# Altium schematic sheet Leds.SchDoc: Extension connectors
size A4; DocumentNumber: MB1136; Revision: C.3; SheetNumber: 4; SheetTotal: 4; Project: NUCLEO-XXXXRX
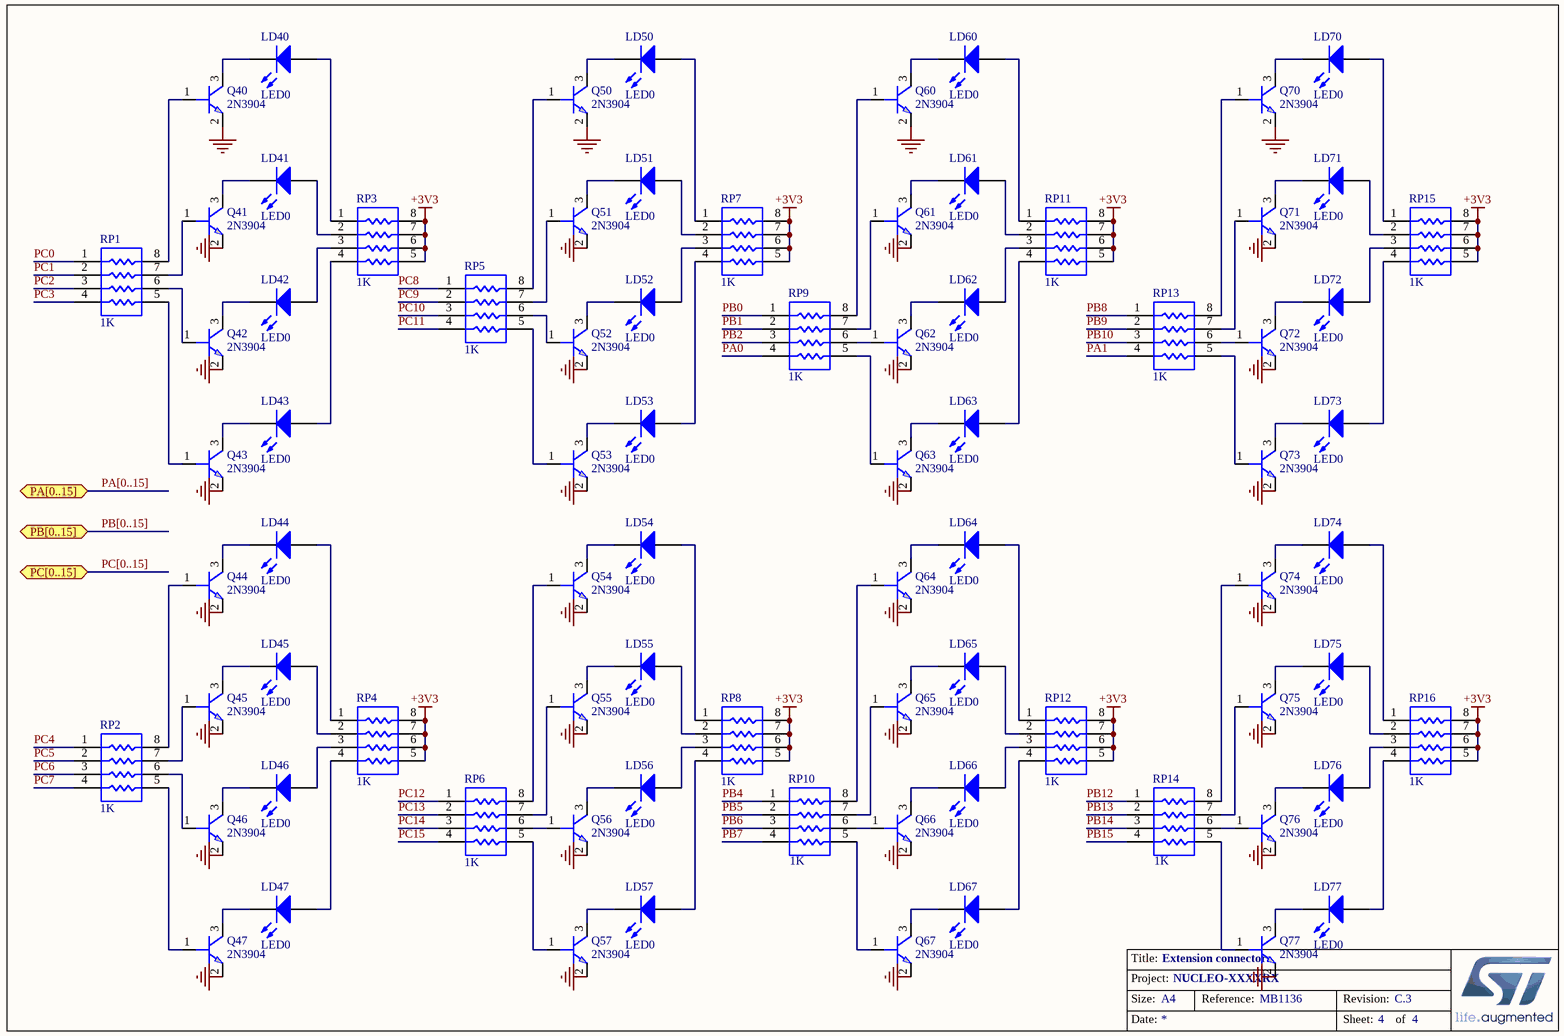
[diagram p0: Leds.SchDoc]

## Parts
LD40  LED0  [LED5]
LD41  LED0  [LED5]
LD42  LED0  [LED5]
LD43  LED0  [LED5]
LD44  LED0  [LED5]
LD45  LED0  [LED5]
LD46  LED0  [LED5]
LD47  LED0  [LED5]
LD50  LED0  [LED5]
LD51  LED0  [LED5]
LD52  LED0  [LED5]
LD53  LED0  [LED5]
LD54  LED0  [LED5]
LD55  LED0  [LED5]
LD56  LED0  [LED5]
LD57  LED0  [LED5]
LD60  LED0  [LED5]
LD61  LED0  [LED5]
LD62  LED0  [LED5]
LD63  LED0  [LED5]
LD64  LED0  [LED5]
LD65  LED0  [LED5]
LD66  LED0  [LED5]
LD67  LED0  [LED5]
LD70  LED0  [LED5]
LD71  LED0  [LED5]
LD72  LED0  [LED5]
LD73  LED0  [LED5]
LD74  LED0  [LED5]
LD75  LED0  [LED5]
LD76  LED0  [LED5]
LD77  LED0  [LED5]
Q40  2N3904  [SOT-23]
Q41  2N3904  [SOT-23]
Q42  2N3904  [SOT-23]
Q43  2N3904  [SOT-23]
Q44  2N3904  [SOT-23]
Q45  2N3904  [SOT-23]
Q46  2N3904  [SOT-23]
Q47  2N3904  [SOT-23]
Q50  2N3904  [SOT-23]
Q51  2N3904  [SOT-23]
Q52  2N3904  [SOT-23]
Q53  2N3904  [SOT-23]
Q54  2N3904  [SOT-23]
Q55  2N3904  [SOT-23]
Q56  2N3904  [SOT-23]
Q57  2N3904  [SOT-23]
Q60  2N3904  [SOT-23]
Q61  2N3904  [SOT-23]
Q62  2N3904  [SOT-23]
Q63  2N3904  [SOT-23]
Q64  2N3904  [SOT-23]
Q65  2N3904  [SOT-23]
Q66  2N3904  [SOT-23]
Q67  2N3904  [SOT-23]
Q70  2N3904  [SOT-23]
Q71  2N3904  [SOT-23]
Q72  2N3904  [SOT-23]
Q73  2N3904  [SOT-23]
Q74  2N3904  [SOT-23]
Q75  2N3904  [SOT-23]
Q76  2N3904  [SOT-23]
Q77  2N3904  [SOT-23]
RP1  1K  [4P8]
RP2  1K  [4P8]
RP3  1K  [4P8]
RP4  1K  [4P8]
RP5  1K  [4P8]
RP6  1K  [4P8]
RP7  1K  [4P8]
RP8  1K  [4P8]
RP9  1K  [4P8]
RP10  1K  [4P8]
RP11  1K  [4P8]
RP12  1K  [4P8]
RP13  1K  [4P8]
RP14  1K  [4P8]
RP15  1K  [4P8]
RP16  1K  [4P8]

## Ports
PA[0..15] (bidir), PB[0..15] (bidir), PC[0..15] (bidir)

## Nets
+3V3: RP3.5 RP3.6 RP3.7 RP3.8 RP4.5 RP4.6 RP4.7 RP4.8 RP7.5 RP7.6 RP7.7 RP7.8 RP8.5 RP8.6 RP8.7 RP8.8 RP11.5 RP11.6 RP11.7 RP11.8 RP12.5 RP12.6 RP12.7 RP12.8 RP15.5 RP15.6 RP15.7 RP15.8 RP16.5 RP16.6 RP16.7 RP16.8
GND: Q40.2(E) Q41.2(E) Q42.2(E) Q43.2(E) Q44.2(E) Q45.2(E) Q46.2(E) Q47.2(E) Q50.2(E) Q51.2(E) Q52.2(E) Q53.2(E) Q54.2(E) Q55.2(E) Q56.2(E) Q57.2(E) Q60.2(E) Q61.2(E) Q62.2(E) Q63.2(E) Q64.2(E) Q65.2(E) Q66.2(E) Q67.2(E) Q70.2(E) Q71.2(E) Q72.2(E) Q73.2(E) Q74.2(E) Q75.2(E) Q76.2(E) Q77.2(E)
PA0: RP9.4
PA1: RP13.4
PB0: RP9.1
PB1: RP9.2
PB2: RP9.3
PB4: RP10.1
PB5: RP10.2
PB6: RP10.3
PB7: RP10.4
PB8: RP13.1
PB9: RP13.2
PB10: RP13.3
PB12: RP14.1
PB13: RP14.2
PB14: RP14.3
PB15: RP14.4
PC0: RP1.1
PC1: RP1.2
PC2: RP1.3
PC3: RP1.4
PC4: RP2.1
PC5: RP2.2
PC6: RP2.3
PC7: RP2.4
PC8: RP5.1
PC9: RP5.2
PC10: RP5.3
PC11: RP5.4
PC12: RP6.1
PC13: RP6.2
PC14: RP6.3
PC15: RP6.4
NetLD40_1: LD40.1(A) RP3.1
NetLD40_2: LD40.2(K) Q40.3(C)
NetLD41_1: LD41.1(A) RP3.2
NetLD41_2: LD41.2(K) Q41.3(C)
NetLD42_1: LD42.1(A) RP3.3
NetLD42_2: LD42.2(K) Q42.3(C)
NetLD43_1: LD43.1(A) RP3.4
NetLD43_2: LD43.2(K) Q43.3(C)
NetLD44_1: LD44.1(A) RP4.1
NetLD44_2: LD44.2(K) Q44.3(C)
NetLD45_1: LD45.1(A) RP4.2
NetLD45_2: LD45.2(K) Q45.3(C)
NetLD46_1: LD46.1(A) RP4.3
NetLD46_2: LD46.2(K) Q46.3(C)
NetLD47_1: LD47.1(A) RP4.4
NetLD47_2: LD47.2(K) Q47.3(C)
NetLD50_1: LD50.1(A) RP7.1
NetLD50_2: LD50.2(K) Q50.3(C)
NetLD51_1: LD51.1(A) RP7.2
NetLD51_2: LD51.2(K) Q51.3(C)
NetLD52_1: LD52.1(A) RP7.3
NetLD52_2: LD52.2(K) Q52.3(C)
NetLD53_1: LD53.1(A) RP7.4
NetLD53_2: LD53.2(K) Q53.3(C)
NetLD54_1: LD54.1(A) RP8.1
NetLD54_2: LD54.2(K) Q54.3(C)
NetLD55_1: LD55.1(A) RP8.2
NetLD55_2: LD55.2(K) Q55.3(C)
NetLD56_1: LD56.1(A) RP8.3
NetLD56_2: LD56.2(K) Q56.3(C)
NetLD57_1: LD57.1(A) RP8.4
NetLD57_2: LD57.2(K) Q57.3(C)
NetLD60_1: LD60.1(A) RP11.1
NetLD60_2: LD60.2(K) Q60.3(C)
NetLD61_1: LD61.1(A) RP11.2
NetLD61_2: LD61.2(K) Q61.3(C)
NetLD62_1: LD62.1(A) RP11.3
NetLD62_2: LD62.2(K) Q62.3(C)
NetLD63_1: LD63.1(A) RP11.4
NetLD63_2: LD63.2(K) Q63.3(C)
NetLD64_1: LD64.1(A) RP12.1
NetLD64_2: LD64.2(K) Q64.3(C)
NetLD65_1: LD65.1(A) RP12.2
NetLD65_2: LD65.2(K) Q65.3(C)
NetLD66_1: LD66.1(A) RP12.3
NetLD66_2: LD66.2(K) Q66.3(C)
NetLD67_1: LD67.1(A) RP12.4
NetLD67_2: LD67.2(K) Q67.3(C)
NetLD70_1: LD70.1(A) RP15.1
NetLD70_2: LD70.2(K) Q70.3(C)
NetLD71_1: LD71.1(A) RP15.2
NetLD71_2: LD71.2(K) Q71.3(C)
NetLD72_1: LD72.1(A) RP15.3
NetLD72_2: LD72.2(K) Q72.3(C)
NetLD73_1: LD73.1(A) RP15.4
NetLD73_2: LD73.2(K) Q73.3(C)
NetLD74_1: LD74.1(A) RP16.1
NetLD74_2: LD74.2(K) Q74.3(C)
NetLD75_1: LD75.1(A) RP16.2
NetLD75_2: LD75.2(K) Q75.3(C)
NetLD76_1: LD76.1(A) RP16.3
NetLD76_2: LD76.2(K) Q76.3(C)
NetLD77_1: LD77.1(A) RP16.4
NetLD77_2: LD77.2(K) Q77.3(C)
NetQ40_1: Q40.1(B) RP1.8
NetQ41_1: Q41.1(B) RP1.7
NetQ42_1: Q42.1(B) RP1.6
NetQ43_1: Q43.1(B) RP1.5
NetQ44_1: Q44.1(B) RP2.8
NetQ45_1: Q45.1(B) RP2.7
NetQ46_1: Q46.1(B) RP2.6
NetQ47_1: Q47.1(B) RP2.5
NetQ50_1: Q50.1(B) RP5.8
NetQ51_1: Q51.1(B) RP5.7
NetQ52_1: Q52.1(B) RP5.6
NetQ53_1: Q53.1(B) RP5.5
NetQ54_1: Q54.1(B) RP6.8
NetQ55_1: Q55.1(B) RP6.7
NetQ56_1: Q56.1(B) RP6.6
NetQ57_1: Q57.1(B) RP6.5
NetQ60_1: Q60.1(B) RP9.8
NetQ61_1: Q61.1(B) RP9.7
NetQ62_1: Q62.1(B) RP9.6
NetQ63_1: Q63.1(B) RP9.5
NetQ64_1: Q64.1(B) RP10.8
NetQ65_1: Q65.1(B) RP10.7
NetQ66_1: Q66.1(B) RP10.6
NetQ67_1: Q67.1(B) RP10.5
NetQ70_1: Q70.1(B) RP13.8
NetQ71_1: Q71.1(B) RP13.7
NetQ72_1: Q72.1(B) RP13.6
NetQ73_1: Q73.1(B) RP13.5
NetQ74_1: Q74.1(B) RP14.8
NetQ75_1: Q75.1(B) RP14.7
NetQ76_1: Q76.1(B) RP14.6
NetQ77_1: Q77.1(B) RP14.5

## Buses and harness runs
bus PA[0..15] = port PA[0..15]
bus PB[0..15] = port PB[0..15]
bus PC[0..15] = port PC[0..15]

## Notes on the sheet
- Title:
- Project:
- Size:
- Date:
- A4
- Reference:
- Sheet:
- Revision:
- of

## Library data of the parts
LD40-LD47 LD50-LD57 LD60-LD67 LD70-LD77 = LED0: Typical INFRARED GaAs LED; Published: 8-Jun-2000; LatestRevisionDate: 08-Jul-2005; LatestRevisionNote: Mech Layer 1 removed.; PackageReference: LED-0; Publisher: Altium Limited; PackageDescription: LED; 2 Leads
Q40-Q47 Q50-Q57 Q60-Q67 Q70-Q77 = 2N5551: Text Field1: 20; Text Field2: 20
RP1-RP16 = RESPACK3_1